# Altium project BTL_test_1.PrjPcb
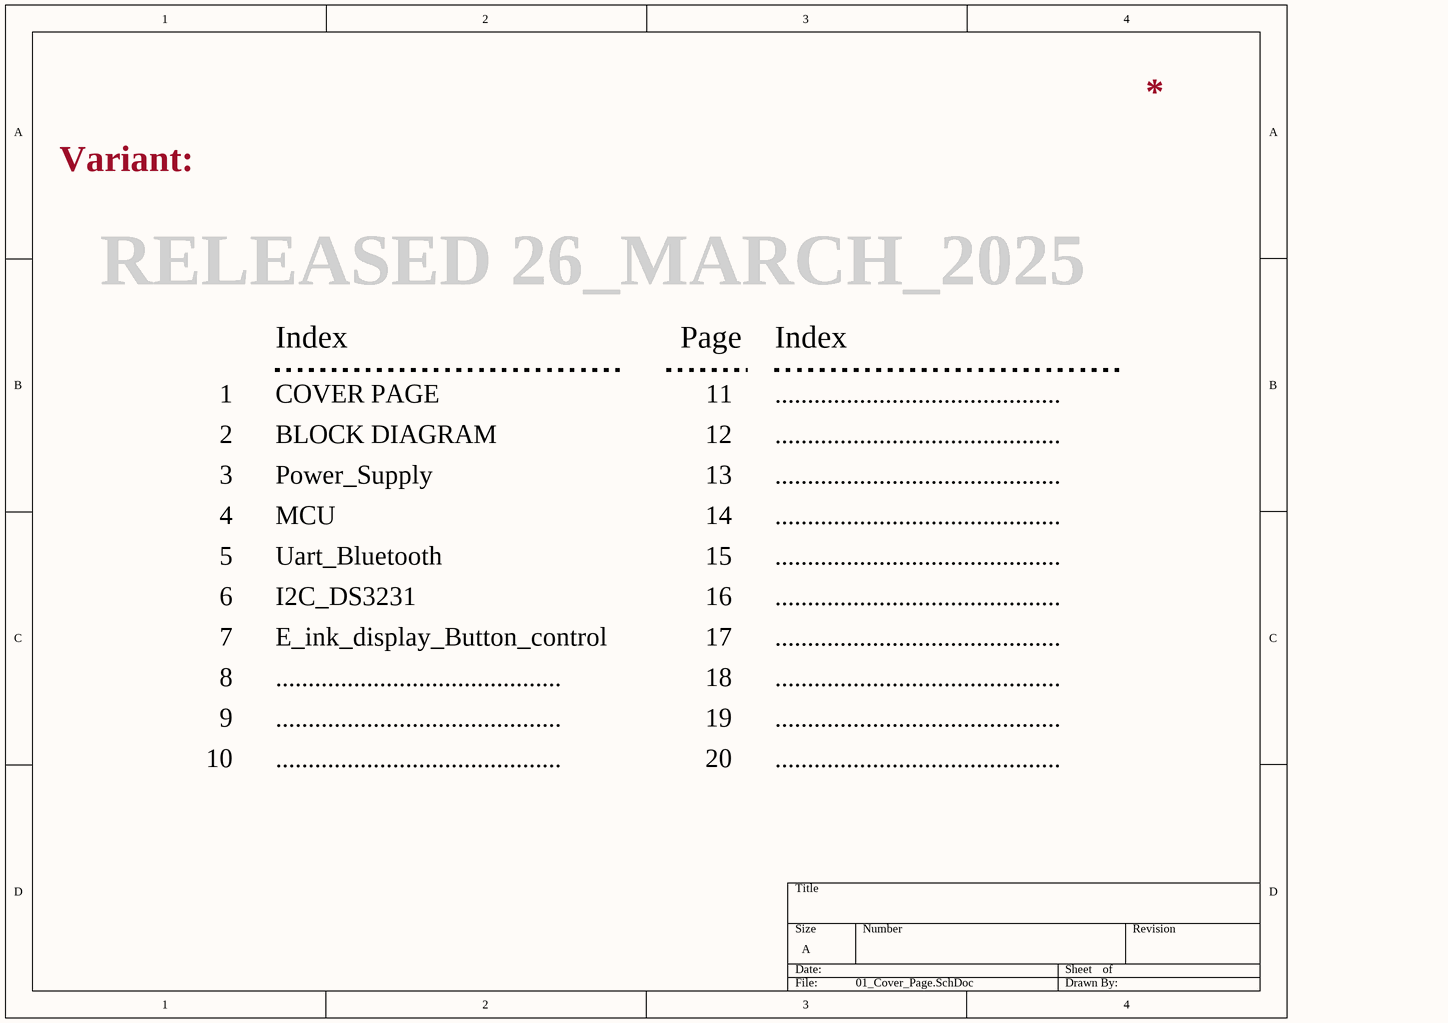
[diagram p0: 01_Cover_Page.SchDoc]
8 sheets, 69 parts. Net scope: global (net labels, ports and power ports of the same name join across sheets).
Board files: version_1.PcbDoc, version_2.PcbDoc, version_3.PcbDoc
Sheets:
  01_Cover_Page.SchDoc
  02_Block_Diagram.SchDoc
  03_Power_Spply.SchDoc
  04_MCU.SchDoc
  05_Uart_Bluetooth.SchDoc
  06_I2C_DS3231.SchDoc
  07_E_ink_display_Button_control.SchDoc
  08_ADC_measure.SchDoc

## Sheet 01_Cover_Page.SchDoc
size A; SheetNumber: 1; SheetTotal: 7

### Notes on the sheet
- Variant:
- RELEASED 26_MARCH_2025
- Index
- Page
- 1
- COVER PAGE
- 11
- ............................................
- 2
- 3
- BLOCK DIAGRAM
- Power_Supply
- 12
- 13
- 4
- 5
- MCU
- Uart_Bluetooth
- 14
- 15
- 6
- I2C_DS3231
- 16
- 7
- 8
- E_ink_display_Button_control
- 17
- 18
- 9
- 10
- 19
- 20

## Sheet 02_Block_Diagram.SchDoc
size A3; SheetNumber: 2; SheetTotal: 8
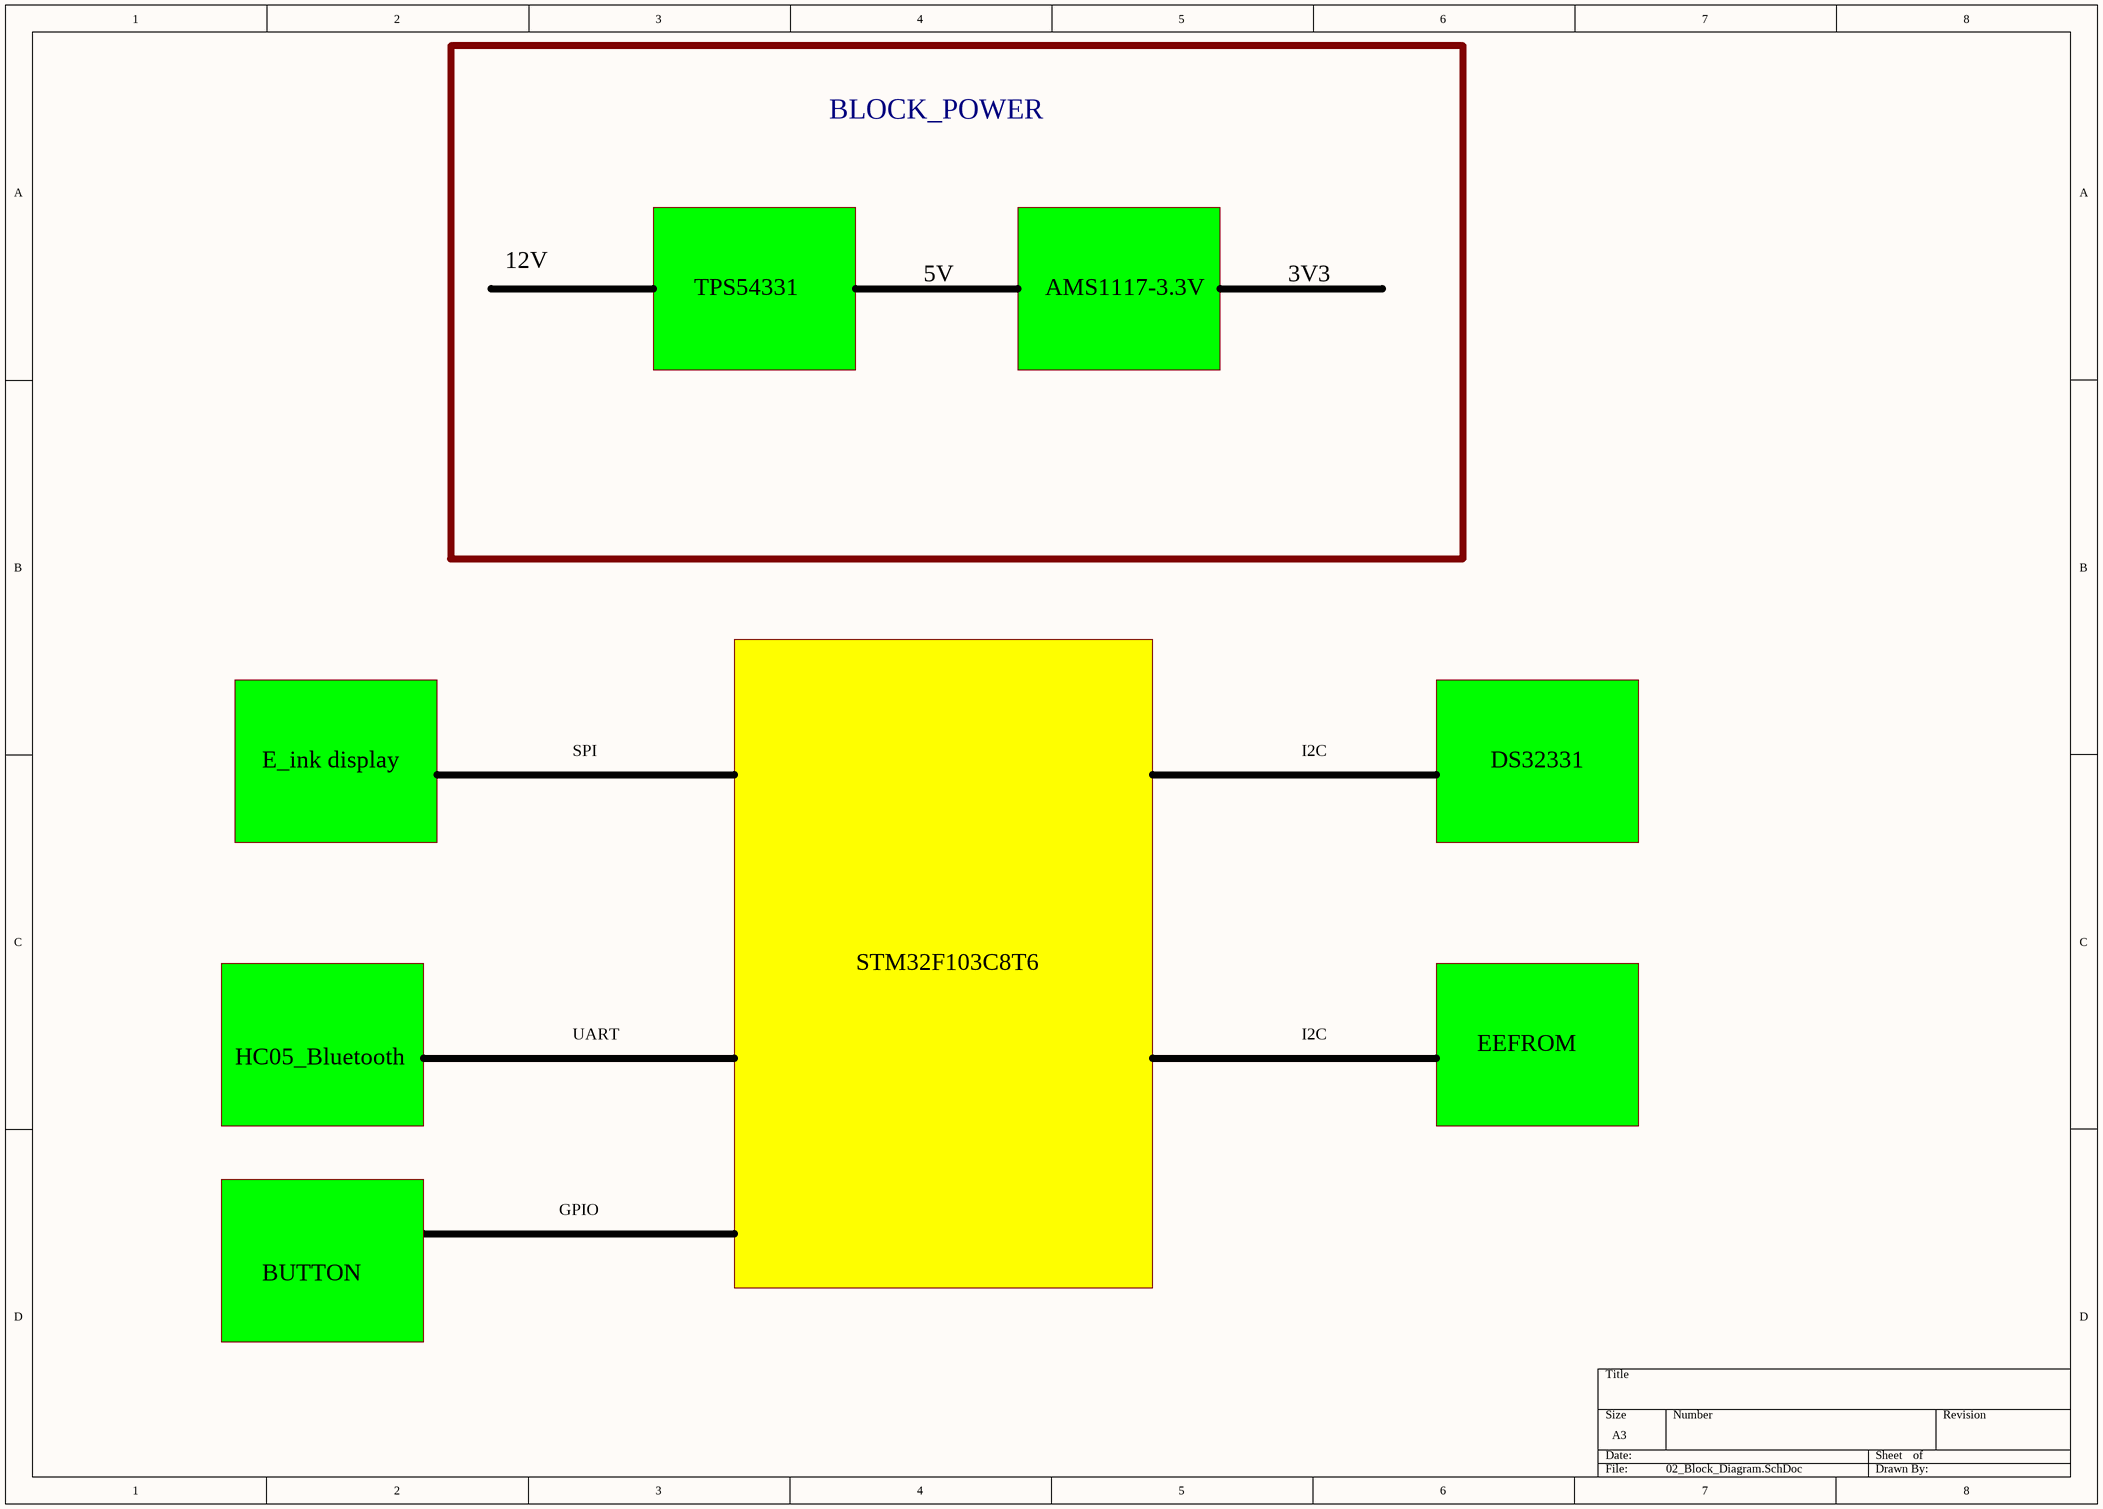
[diagram p1: 02_Block_Diagram.SchDoc]

### Notes on the sheet
- BLOCK_POWER
- 12V
- TPS54331
- 5V
- AMS1117-3.3V
- 3V3
- E_ink display
- SPI
- I2C
- DS32331
- STM32F103C8T6
- UART
- EEFROM
- HC05_Bluetooth
- GPIO
- BUTTON

## Sheet 03_Power_Spply.SchDoc
size A3; SheetNumber: 3; SheetTotal: 8
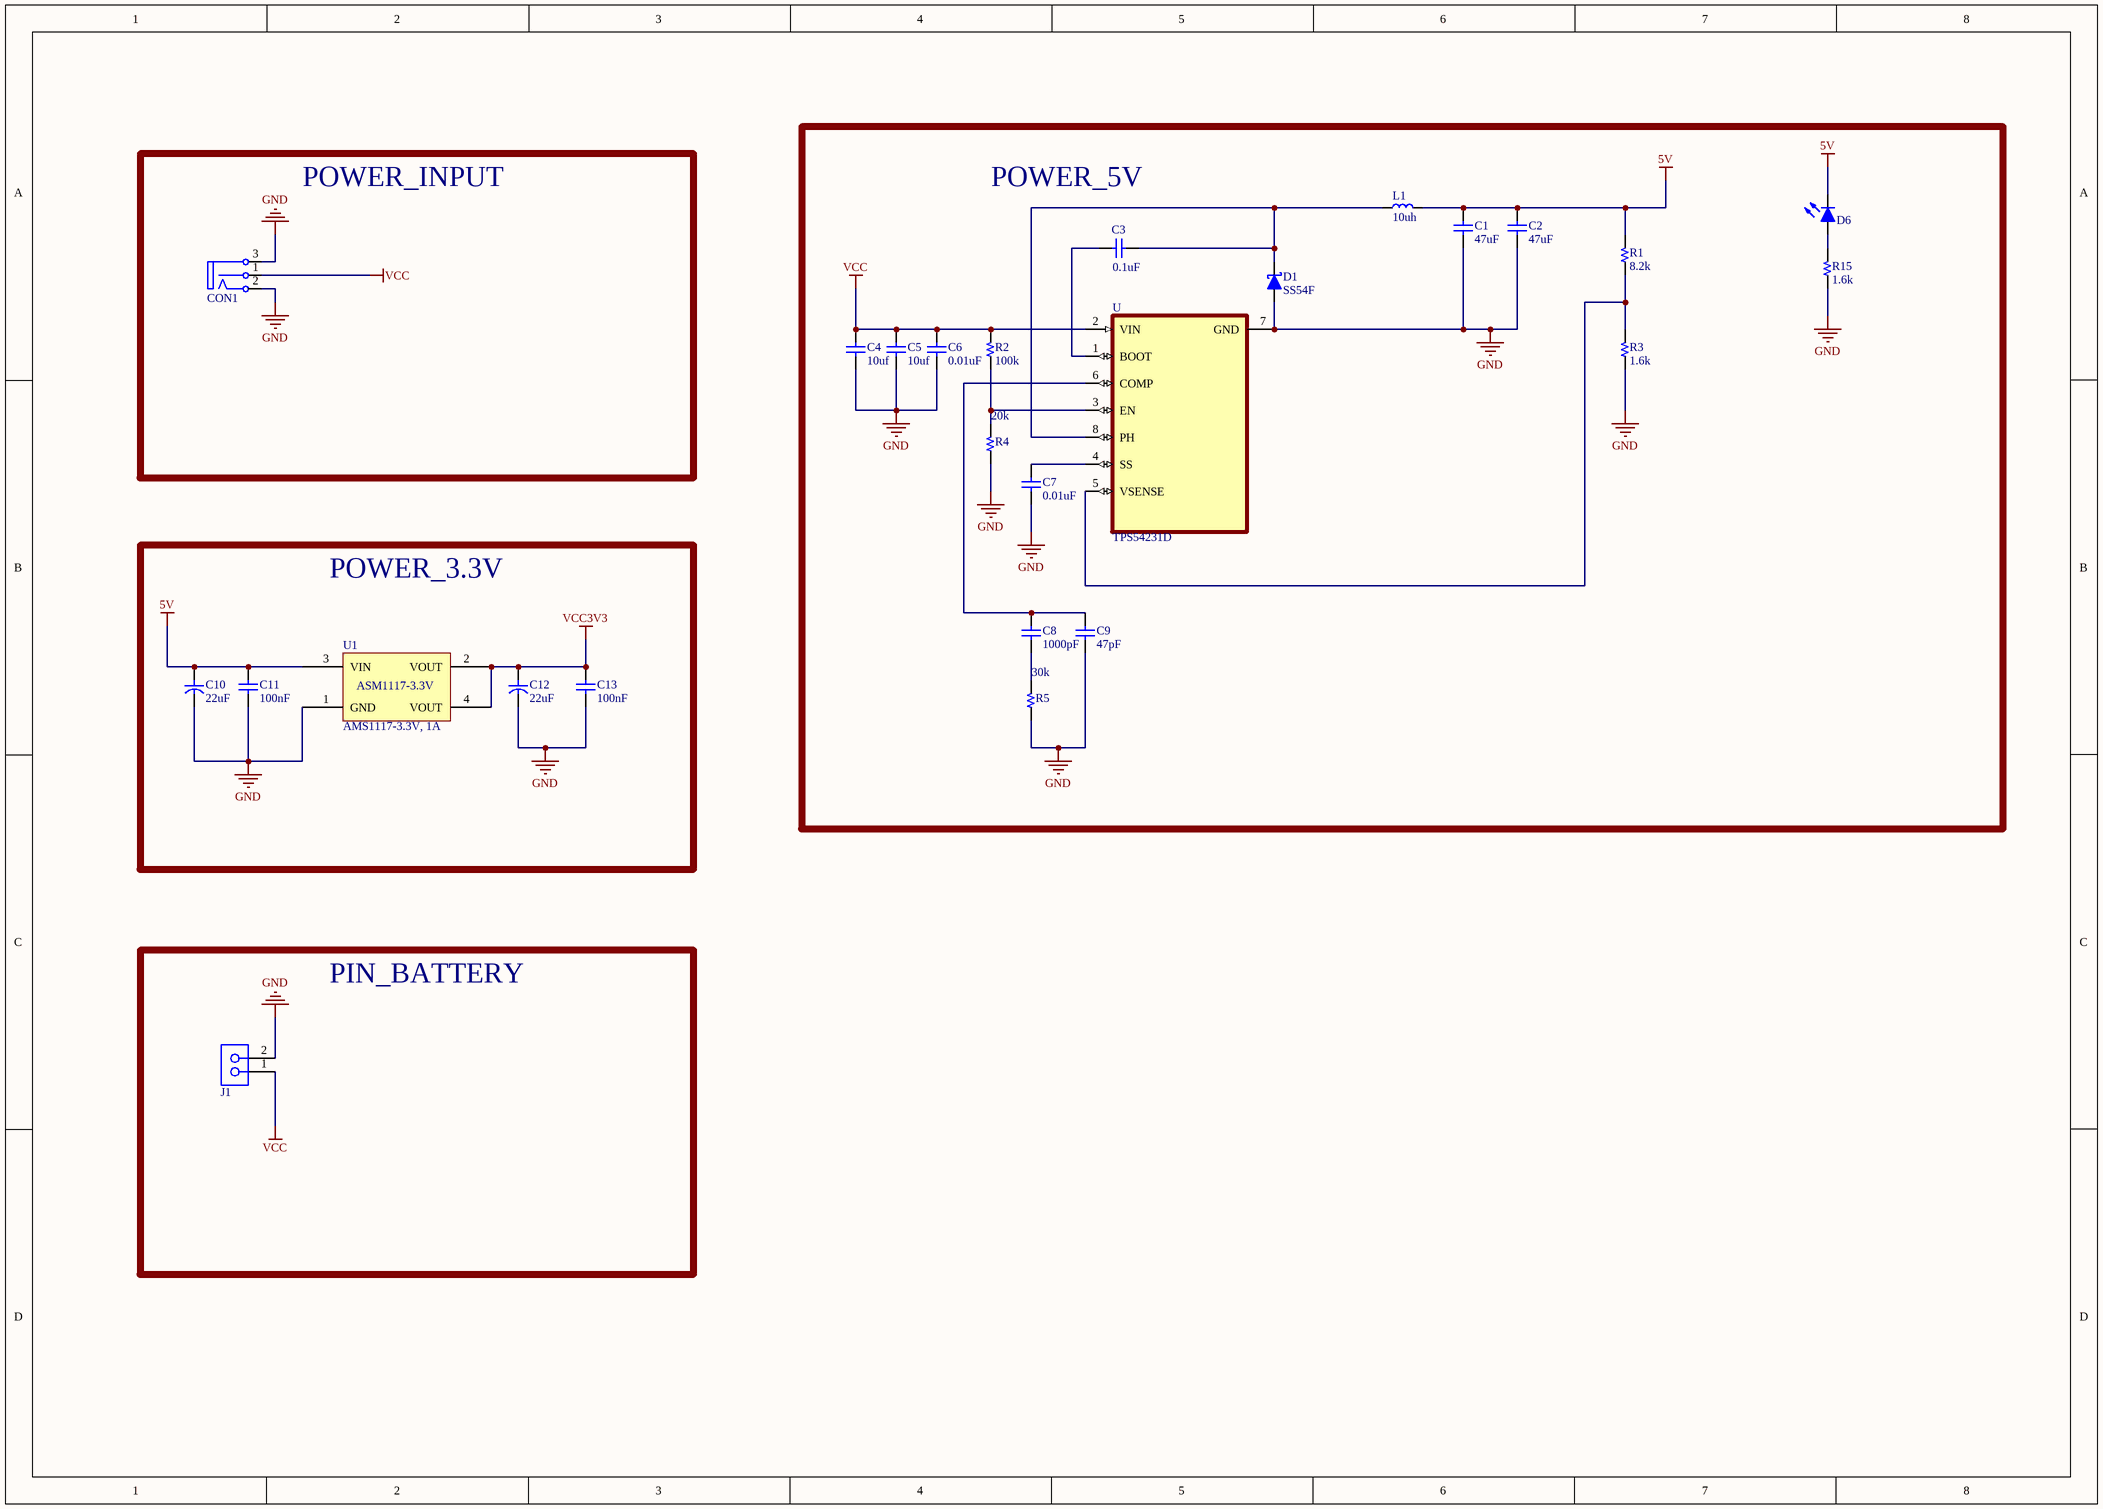
[diagram p2: 03_Power_Spply.SchDoc]

### Parts
C1  47uF  [C 0805]
C2  47uF  [C 0805]
C3  0.1uF  [C 0805]
C4  10uf  [C 0805]
C5  10uf  [C 0805]
C6  0.01uF  [C 0805]
C7  0.01uF  [C 0805]
C8  1000pF  [C 0805]
C9  47pF  [C 0805]
C10  22uF  [C SMD TAN 2312 (C)]
C11  100nF  [C 0805]
C12  22uF  [C SMD TAN 2312 (C)]
C13  100nF  [C 0805]
CON1  CON DC PWR  [CONN/DC/PWR/5.0MM]  (value not drawn)
D1  SS54F  [DO-214AC (SMA)]
D6  Led  [Led 0805]  (value not drawn)
J1  6A, 150V  [691402910002B]  (value not drawn)
L1  10uh  [Inductor SMD CDRH3D67]
R1  8.2k  [R 0805]
R2  100k  [R 0805]
R3  1.6k  [R 0805]
R4  20k  [R 0805]
R5  30k  [R 0805]
R15  1.6k  [R 0805]
U  TPS54231D  [SOIC127P599X175-8N]
U1  AMS1117-3.3V, 1A  [AMS1117-3.3V SOT223]

### Blocks framed on the sheet
POWER_5V: C1-C9 D1 D6 L1 R1-R5 R15 U
POWER_INPUT: CON1
POWER_3.3V: C10-C13 U1
PIN_BATTERY: J1

### Nets
5V: C1.2 C2.2 C10.1 C11.2 D6.2(K) L1.2 R1.2 U1.3(VIN)
GND: C1.1 C2.1 C4.1 C5.1 C6.1 C7.1 C9.1 C10.2 C11.1 C12.2 C13.1 CON1.2(T) CON1.3(TN) D1.1(A) J1.2 R3.1 R4.1 R5.1 R15.1 U.7(GND) U1.1(GND)
VCC: C4.2 C5.2 C6.2 CON1.1(S) J1.1 R2.2 U.2(VIN)
VCC3V3: C12.1 C13.2 U1.2(VOUT) U1.4(VOUT)
NetC3_1: C3.1 D1.2(K) L1.1 U.8(PH)
NetC3_2: C3.2 U.1(BOOT)
NetC7_2: C7.2 U.4(SS)
NetC8_1: C8.1 R5.2
NetC8_2: C8.2 C9.2 U.6(COMP)
NetD6_1: D6.1(A) R15.2
NetR1_1: R1.1 R3.2 U.5(VSENSE)
NetR2_1: R2.1 R4.2 U.3(EN)

### Notes on the sheet
- (in symbol AMS1117-3.3V) ASM1117-3.3V

### Library data of the parts
C1-C9 C11 C13 = Capacitor NP: Capacitor non-pol
C10 C12 = Capacitor: Capacitor pol
CON1 = CON DC PWR: DC input connector
D1 = Diode Schottky: Schottky Diode
D6 = Led: Typical LED
J1 = 691402910002B: WR-TBL Series 4029 Horizontal Entry, THT, pitch 2.54mm, 2p; Manufacturer: Wurth Elektronik; Modularity: No; ComponentLink1Description: Datasheet; ComponentLink1URL: https://www.we-online.com/redexpert/spec/691402910002B?ad; Manufacturer Part Number: 691402910002B; Category: Terminal Blocks; Match Code: WR-TBL; Mount: Through Hole; Operating Temperature Max: 105°C; Operating Temperature Min: -40°C; Packaging: Box; Application: Screwless; Number of Pins: 2; Number of Rows: 1; Orientation: Horizontal; Pitch: 2.54mm; Rated Current: 6A; Working Voltage: 150V; Supplier 1 URL: N/A; Supplier 2 URL: N/A; Supplier 3 URL: https://www.thegioiic.com/kf141-2-54-2-r-terminal-block-2-tiep-diem-cam-day-ngang-2-54mm-150v-2a; Value: 6A, 150V; LCSC Part #: N/A; Supplier 1: Mouser; Supplier 1 Part Number: N/A; Supplier 2: Digi-Key; Supplier 2 Part Number: N/A; Supplier 3: thegioiic; Supplier 3 Part Number: N/A
L1 = Inductor
R1-R5 R15 = Resistor
U = TPS54231D: å…·æœ‰Eco-modeï¼†tradeçš„3.5è‡³28Vè¾“å…¥ï¼Œ2Aï¼Œ570kHzé™åŽ‹è½¬æ¢å™¨ï¼›8-SOIC -40è‡³150; MF: Texas Instruments; DigiKey-Purchase-URL: https://snapeda.com/shop?store=DigiKey&id=456068; Value: *; MP: TPS54231D; Availability: Unavailable; Price: None; Texas_Instruments-Purchase-URL: https://snapeda.com/shop?store=Texas+Instruments&id=456068; Package: SOIC-8 Texas Instruments; SnapEDA_Link: https://www.snapeda.com/parts/TPS54231D/Texas%20Instruments/view-part/456068/?ref=snap
U1 = AMS1117-3.3V: 1A 60dB@(120Hz) Fixed 3.3V Positive electrode 12V SOT-223 Linear Voltage Regulators (LDO) ROHS; Manufacturer: AMS; Pad Count: 4; Voltage Input Maximum: 15V; Manufacturer Part Number: N/A; Current Input Maximum: N/A; Current Output Maximum: 1A; Voltage Output: 3.3V; Supplier 1 URL: N/A; Supplier 2 URL: N/A; Supplier 3 URL: https://www.thegioiic.com/ams1117-3-3v-ic-on-ap-3-3v-1a-sot-223; Value: AMS1117-3.3V, 1A; Mount: SMD/SMT; Operating Temperature Max: + 85 C; Operating Temperature Min: - 40 C; Packaging: Tape and Reel; Supplier 1: Mouser; Supplier 1 Part Number: N/A; Supplier 2: Digi-Key; Supplier 2 Part Number: N/A; Supplier 3: thegioiic; Supplier 3 Part Number: N/A; ComponentLink1Description: Datasheet; ComponentLink1URL: http://www.advanced-monolithic.com/pdf/ds1117.pdf; LCSC Part #: C347222

## Sheet 04_MCU.SchDoc
size A3; SheetNumber: 4; SheetTotal: 8
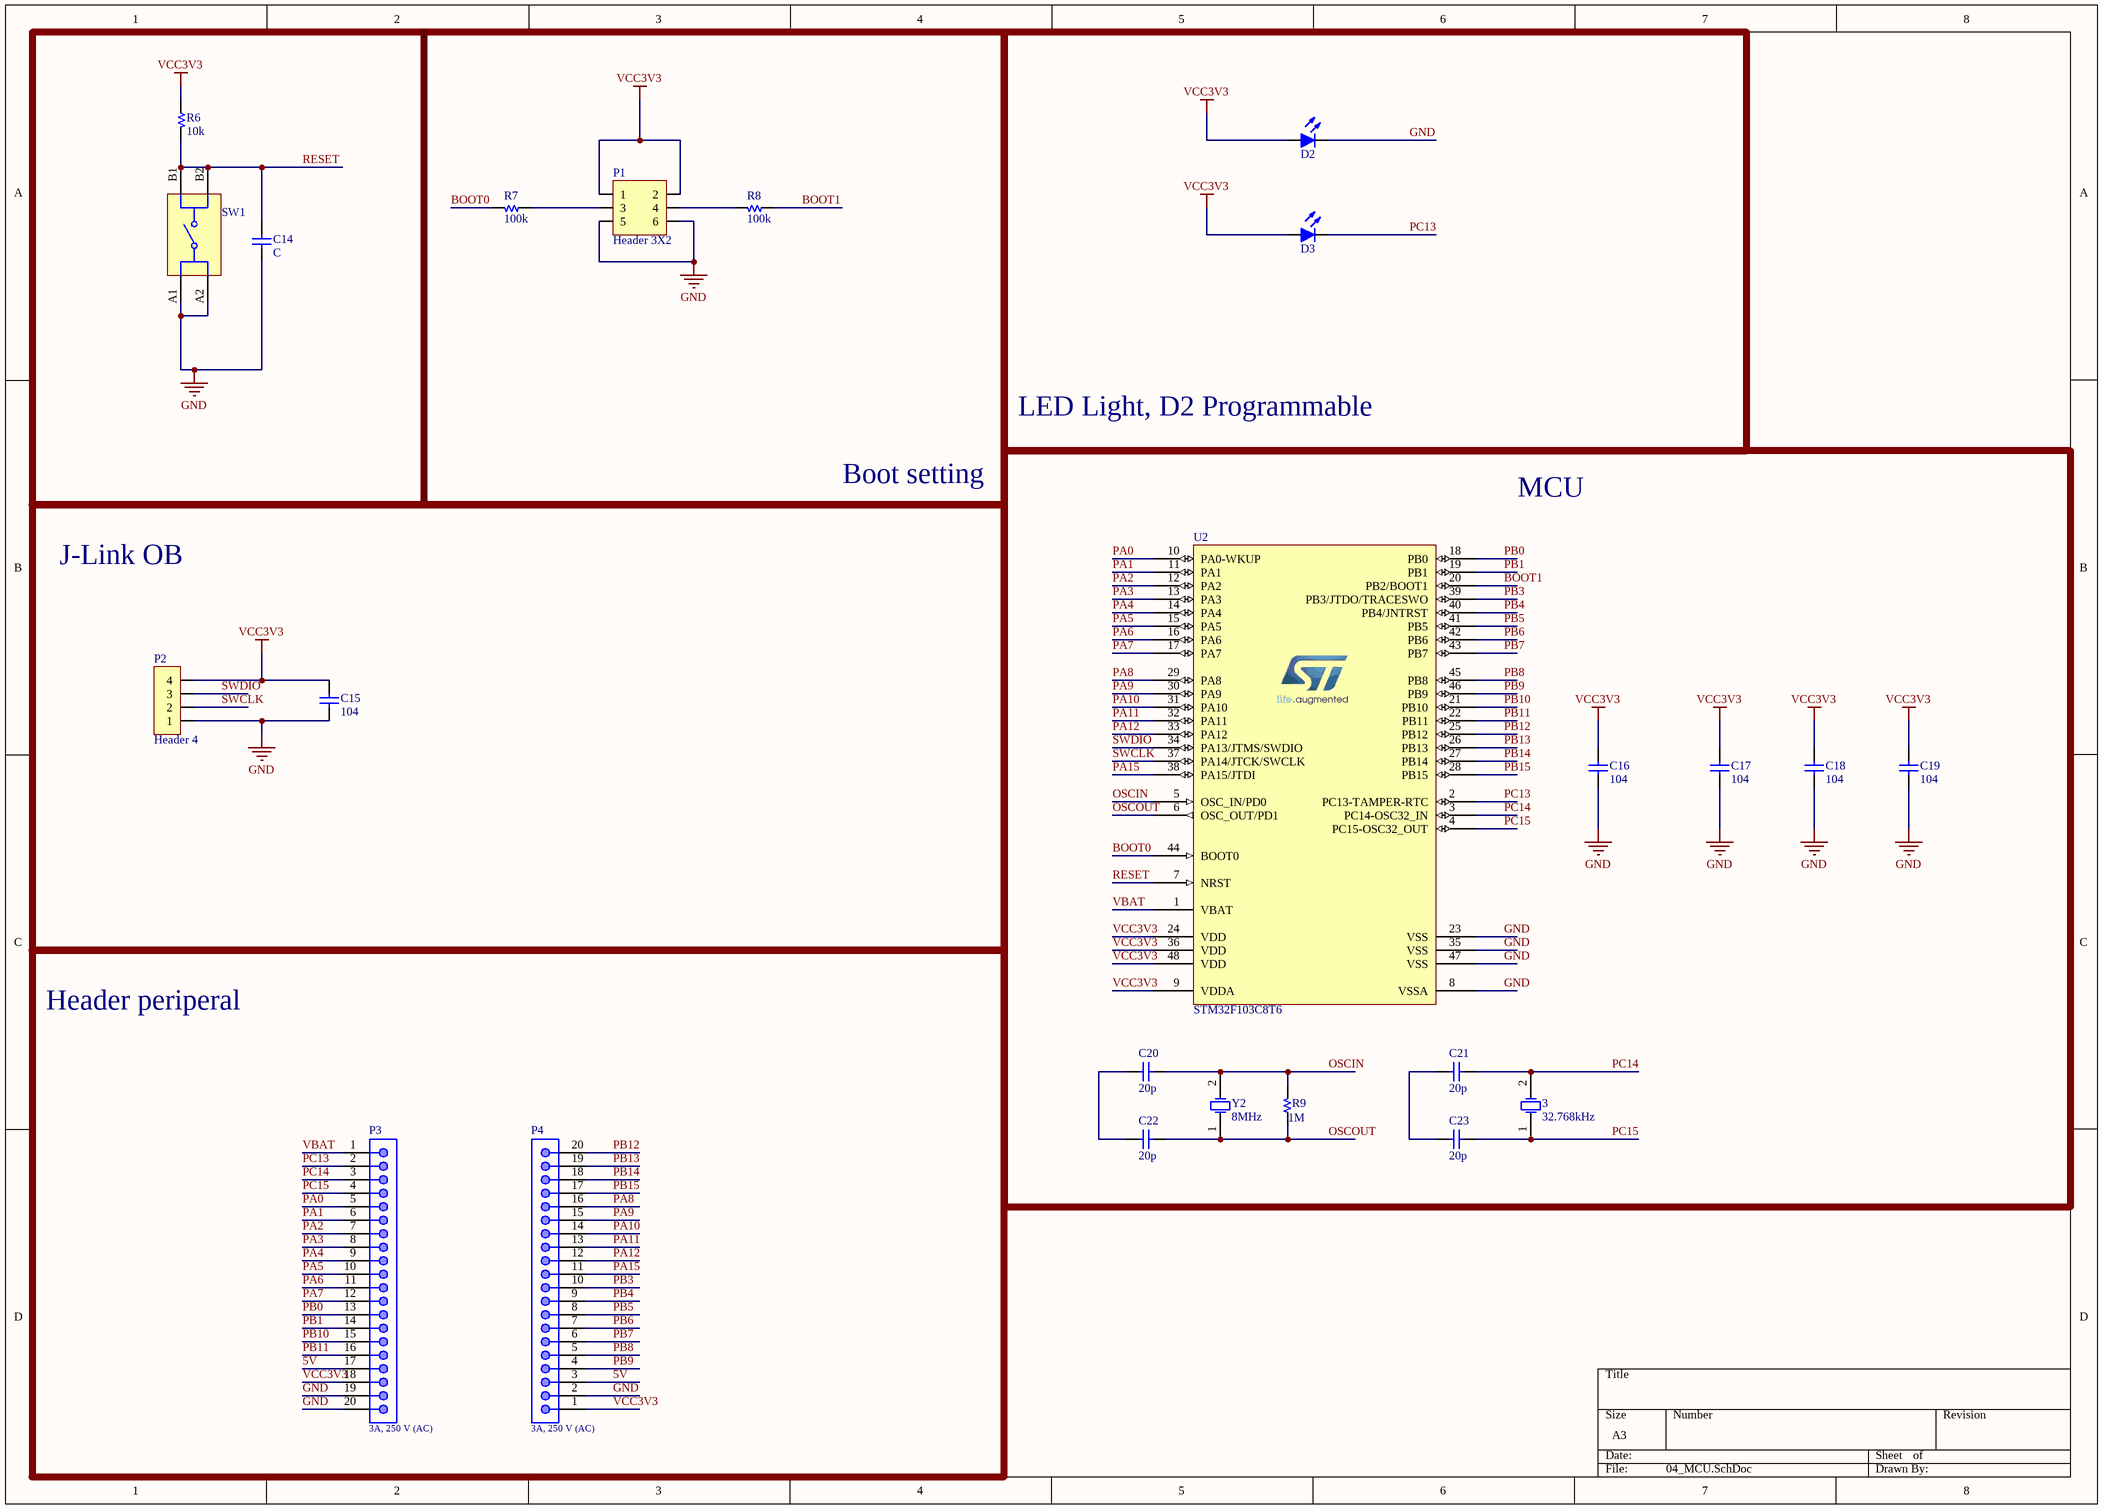
[diagram p3: 04_MCU.SchDoc]

### Parts
3  32.768kHz  [XKXGI-SUA-32.768K]
C14  C  [C 0805]
C15  104  [C 0805]
C16  104  [C 0805]
C17  104  [C 0805]
C18  104  [C 0805]
C19  104  [C 0805]
C20  20p  [C 0805]
C21  20p  [C 0805]
C22  20p  [C 0805]
C23  20p  [C 0805]
D2  Led  [Led 0805]  (value not drawn)
D3  Led  [Led 0805]  (value not drawn)
P1  Header 3X2  [HDR/Header/6/DL]
P2  Header 4  [HDR/Header/4]
P3  3A, 250 V (AC)  [61302011121]
P4  3A, 250 V (AC)  [61302011121]
R6  10k  [R 0805]
R7  100k  [R 0805]
R8  100k  [R 0805]
R9  1M  [R 0805]
SW1  430152043826  [WS-TASV_L6W6H4.3_4301x20438x6]  (value not drawn)
U2  STM32F103C8T6  [STM32F103C8T6]
Y2  8MHz  [WE-XTAL_HC49/4HSMX]

### Blocks framed on the sheet
Boot setting: C14 P1 R6-R8 SW1
LED Light, D2 Programmable: D2 D3
MCU: 3 C16-C23 R9 U2 Y2
Header periperal: P3 P4

### Nets
5V: P3.17 P4.3
GND: C14.2 C15.2 C16.1 C17.1 C18.1 C19.1 D2.2(K) P1.5 P1.6 P2.1 P3.19 P3.20 P4.2 SW1.A1 SW1.A2 U2.8(VSSA) U2.23(VSS) U2.35(VSS) U2.47(VSS)
VCC3V3: C15.1 C16.2 C17.2 C18.2 C19.2 D2.1(A) D3.1(A) P1.1 P1.2 P2.4 P3.18 P4.1 R6.1 U2.9(VDDA) U2.24(VDD) U2.36(VDD) U2.48(VDD)
BOOT0: R7.2 U2.44(BOOT0)
BOOT1: R8.1 U2.20(PB2/BOOT1)
OSCIN: C20.1 R9.2 U2.5(OSC_IN/PD0) Y2.2(OSC2)
OSCOUT: C22.1 R9.1 U2.6(OSC_OUT/PD1) Y2.1(OSC1)
PA0: P3.5 U2.10(PA0-WKUP)
PA1: P3.6 U2.11(PA1)
PA2: P3.7 U2.12(PA2)
PA3: P3.8 U2.13(PA3)
PA4: P3.9 U2.14(PA4)
PA5: P3.10 U2.15(PA5)
PA6: P3.11 U2.16(PA6)
PA7: P3.12 U2.17(PA7)
PA8: P4.16 U2.29(PA8)
PA9: P4.15 U2.30(PA9)
PA10: P4.14 U2.31(PA10)
PA11: P4.13 U2.32(PA11)
PA12: P4.12 U2.33(PA12)
PA15: P4.11 U2.38(PA15/JTDI)
PB0: P3.13 U2.18(PB0)
PB1: P3.14 U2.19(PB1)
PB3: P4.10 U2.39(PB3/JTDO/TRACESWO)
PB4: P4.9 U2.40(PB4/JNTRST)
PB5: P4.8 U2.41(PB5)
PB6: P4.7 U2.42(PB6)
PB7: P4.6 U2.43(PB7)
PB8: P4.5 U2.45(PB8)
PB9: P4.4 U2.46(PB9)
PB10: P3.15 U2.21(PB10)
PB11: P3.16 U2.22(PB11)
PB12: P4.20 U2.25(PB12)
PB13: P4.19 U2.26(PB13)
PB14: P4.18 U2.27(PB14)
PB15: P4.17 U2.28(PB15)
PC13: D3.2(K) P3.2 U2.2(PC13-TAMPER-RTC)
PC14: 3.2(OSC2) C21.1 P3.3 U2.3(PC14-OSC32_IN)
PC15: 3.1(OSC1) C23.1 P3.4 U2.4(PC15-OSC32_OUT)
RESET: C14.1 R6.2 SW1.B1 SW1.B2 U2.7(NRST)
SWCLK: P2.2 U2.37(PA14/JTCK/SWCLK)
SWDIO: P2.3 U2.34(PA13/JTMS/SWDIO)
VBAT: P3.1 U2.1(VBAT)
NetC20_2: C20.2 C22.2
NetC21_2: C21.2 C23.2
NetP1_3: P1.3 R7.1
NetP1_4: P1.4 R8.2

### Notes on the sheet
- J-Link OB

### Library data of the parts
3 = XKXGI-SUA-32.768K: 32.768kHz Surface Mount Crystal 12.5pF ±20ppm ±30ppm SMD3215-2P Crystals ROHS; Manufacturer: YXC Crystal Oscillators; Frequency Stability: +/-30ppm; Frequency Tolerance: +/-20ppm; ComponentLink1Description: Datasheet; ComponentLink1URL: https://www.lcsc.com/datasheet/lcsc_datasheet_2210261730_YXC-Crystal-Oscillators-XKXGI-SUA-32-768K_C5213671.pdf; Frequency: 32.768kHz; LCSC Part #: C5213671; Load Capacitance: 12.5pF; Manufacturer Part Number: XKXGI-SUA-32.768K; Mount: SMD/SMT; Operating Temperature Max: + 85 C; Operating Temperature Min: - 40 C; Package / Case: SMD3215-2P; Packaging: Tape and Reel; Supplier 1: Mouser; Supplier 1 Part Number: N/A; Supplier 1 URL: N/A; Supplier 2: Digi-Key; Supplier 2 Part Number: N/A; Supplier 2 URL: N/A; Supplier 3: thegioiic; Supplier 3 Part Number: N/A; Supplier 3 URL: N/A; Value: 32.768kHz
C14-C23 = Capacitor NP: Capacitor non-pol
D2 D3 = Led: Typical LED
P1 = Header 3X2: Header, 3-Pin, Dual row
P2 = Header 4: Header, 4-Pin
P3 P4 = 61302011121: WR-PHD Pin Header, THT, pitch 2.54mm, Single Row, Vertical, 20p; Manufacturer: Wurth Elektronik; Pin Number: 20; Working Voltage: 250VAC; Withstanding Voltage: 500VAC; Contact Resistance: 20mOhm; ComponentLink1Description: Datasheet; ComponentLink1URL: https://www.we-online.com/catalog/datasheet/61302011121.pdf; Manufacturer Part Number: 61302011121; Published Date: May 2020; Pitch: 2.54mm; Packaging: Bag; Gender: Pin Header; Rated Current: 3A; Row Number: Single; Orientation: Vertical; Supplier 1 URL: https://www.mouser.vn/ProductDetail/Wurth-Elektronik/61302011121?qs=PhR8RmCirEbj%2FFsnpbhNaw%3D%3D; Supplier 2 URL: N/A; Supplier 3 URL: N/A; LCSC Part #: N/A; Mount: THT; Operating Temperature Max: + 85 C; Operating Temperature Min: - 25 C; Supplier 1: Mouser; Supplier 1 Part Number: 710-61302011121; Supplier 2: Digi-Key; Supplier 2 Part Number: N/A; Supplier 3: thegioiic; Supplier 3 Part Number: N/A; Value: 3A, 250 V (AC)
R6-R9 = Resistor
SW1 = 430152043826: WS-TASV SMT Tact Switch, L6 x W6 x H4.3mm, 260g, SPST-NO, 12V, 50mA; Manufacturer: Wurth Elektronik; Washable: No; Rated Voltage: 12VDC; Manufacturer Part Number: 430152043826; Category: Tact Switches; Match Code: WS-TASV; Mount: Surface Mount; Operating Temperature Max: 85°C; Operating Temperature Min: -40°C; Packaging: Tape and Reel; Length: 6mm; Width: 6mm; Height: 4.3mm; Circuit: SPST-NO; Contact Material: Stainless Steel; Operation Force: 260g; Rated Current: 50mA; Terminal Material: Copper Alloy; Terminal Plating: Silver; Supplier 1 URL: https://www.mouser.vn/ProductDetail/Wurth-Elektronik/430152043826?qs=wr8lucFkNMUjBcFj1giTsA%3D%3D; Supplier 2 URL: https://www.digikey.com/en/products/detail/w%C3%BCrth-elektronik/430152043826/5208994; Supplier 3 URL: https://www.thegioiic.com/nut-nhan-6x6mm-cao-4-3mm-4-chan-smd; LCSC Part #: N/A; ComponentLink1Description: Datasheet; ComponentLink1URL: https://www.we-online.com/redexpert/spec/430152043826?ad; Package / Case: 0805; Supplier 1: Mouser; Supplier 1 Part Number: 710-430152043826; Supplier 2: Digi-Key; Supplier 2 Part Number: 732-6991-2-ND; Supplier 3: thegioiic; Supplier 3 Part Number: OEM; Value: 430152043826
U2 = STM32F103C8T6: ARM Microcontrollers - MCU 32BIT Cortex M3 64KB 20KB RAM 2X12 ADC; Manufacturer: STMicroelectronics; Manufacturer Part Number: STM32F103C8T6TR; Pad count: 48; Supply Voltage - Max: 3.6 V; Supply Voltage - Min: 2 V; Part Number: STM32F103C8T6; Value: STM32F103C8T6; Supplier 1 URL: https://www.mouser.com/ProductDetail/STMicroelectronics/STM32F103C8T6?qs=bhCVus9SdFtq6kqxsU5%2FDA%3D%3D; Supplier 2 URL: https://www.digikey.com/en/products/detail/stmicroelectronics/stm32f103c8t6tr/2122442; Supplier 3 URL: https://www.thegioiic.com/stm32f103c8t6-32-bit-arm-cortex-m3-microcontroller-72mhz-64kb-flash-48-lqfp; Packaging: Tape and Reel; Supplier 1: Mouser; Supplier 1 Part Number: 511-STM32F103C8T6; Supplier 2: Digi-Key; Supplier 2 Part Number: 497-17666-2-ND; Supplier 3: thegioiic; Supplier 3 Part Number: STM32F103C8T6; Mount: SMD/SMT; Operating Temperature Max: + 85 C; Operating Temperature Min: - 40 C; Package / Case: LQFP48; ComponentLink1Description: Datasheet; ComponentLink1URL: https://www.mouser.com/datasheet/2/389/stm32f103c8-1851025.pdf; LCSC Part #: C8734
Y2 = 071105086016: WE-XTAL Quartz Crystal, SMT, HC49/4HSMX, 8MHz, +/-30ppm; Manufacturer Part Number: 830003151; Manufacturer: Wurth Elektronik; Frequency Stability: +/-50ppm; Load Capacitance: 16pF; Frequency: 8MHz; Frequency Tolerance: +/-30ppm; Supplier 3 URL: https://www.thegioiic.com/thach-anh-8mhz-2-chan-smd-hc49-s; ComponentLink1Description: Datasheet; ComponentLink1URL: https://katalog.we-online.com/pbs/datasheet/830003151.pdf; Supplier 1 URL: https://www.mouser.com/ProductDetail/Wurth-Elektronik/830003151?qs=2WXlatMagcHisY7XHApyYg%3D%3D; Supplier 2 URL: https://www.digikey.com/en/products/detail/w%C3%BCrth-elektronik/830003151/13979296; Value: 8MHz; Mount: SMD/SMT; Operating Temperature Max: + 60 C; Operating Temperature Min: - 10 C; Package / Case: HC49/4HSMX; Packaging: Tape and Reel; Supplier 1: Mouser; Supplier 1 Part Number: 710-830003151; Supplier 2: Digi-Key; Supplier 2 Part Number: 732-830003151TR-ND; Supplier 3: thegioiic; Supplier 3 Part Number: N/A

## Sheet 05_Uart_Bluetooth.SchDoc
size A3; SheetNumber: 5; SheetTotal: 8
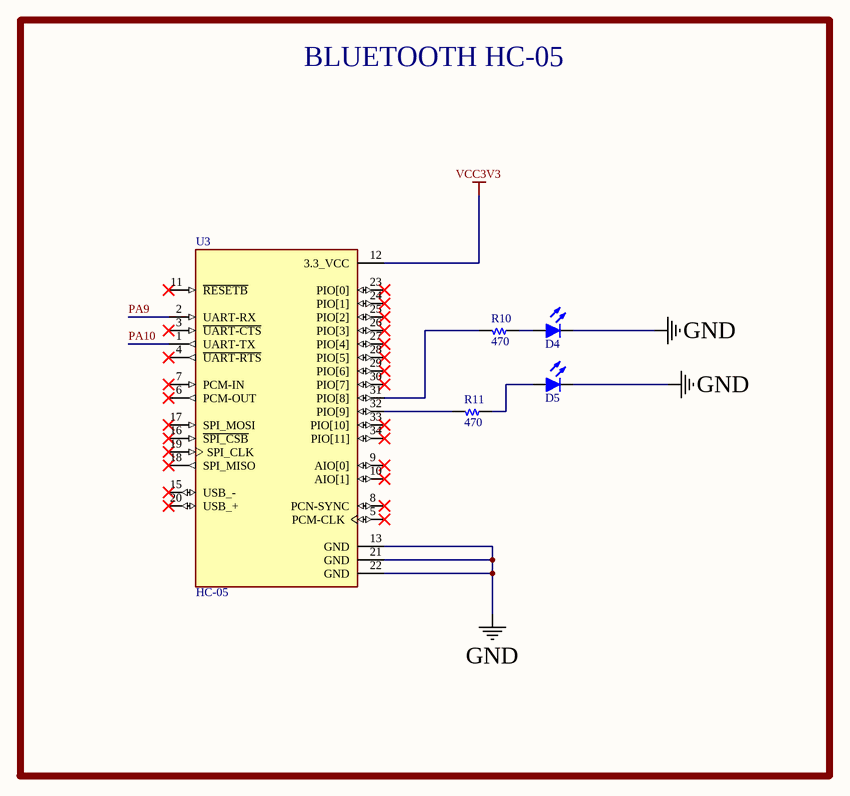
[diagram p4: 05_Uart_Bluetooth.SchDoc]

### Parts
D4  Led  [Led 0805]  (value not drawn)
D5  Led  [Led 0805]  (value not drawn)
R10  470  [R 0805]
R11  470  [R 0805]
U3  HC-05  [XCVR_HC-05]

### Blocks framed on the sheet
BLUETOOTH HC-05: D4 D5 R10 R11 U3

### Nets
GND: D4.2(K) D5.2(K) U3.13(GND) U3.21(GND) U3.22(GND)
VCC3V3: U3.12(3.3_VCC)
PA9: U3.2(UART-RX)
PA10: U3.1(UART-TX)
NetD4_1: D4.1(A) R10.1
NetD5_1: D5.1(A) R11.1
NetR10_2: R10.2 U3.31(PIO[8])
NetR11_2: R11.2 U3.32(PIO[9])

Not connected (* = marked no-connect by the designer): U3 3(~{UART-CTS})* 4(~{UART-RTS})* 5(PCM-CLK)* 6(PCM-OUT)* 7(PCM-IN)* 8(PCN-SYNC)* 9(AIO[0])* 10(AIO[1])* 11(~{RESETB})* 15(USB_-)* 16(~{SPI_CSB})* 17(SPI_MOSI)* 18(SPI_MISO)* 19(SPI_CLK)* 20(USB_+)* 23(PIO[0])* 24(PIO[1])* 25(PIO[2])* 26(PIO[3])* 27(PIO[4])* 28(PIO[5])* 29(PIO[6])* 30(PIO[7])* 33(PIO[10])* 34(PIO[11])*

### Library data of the parts
D4 D5 = Led: Typical LED
R10 R11 = Resistor
U3 = HC-05: Bluetooth to Serial Port Module; MP: HC-05; Value: *; Price: None; Package: None; Availability: Unavailable

## Sheet 06_I2C_DS3231.SchDoc
size A3; SheetNumber: 5; SheetTotal: 5
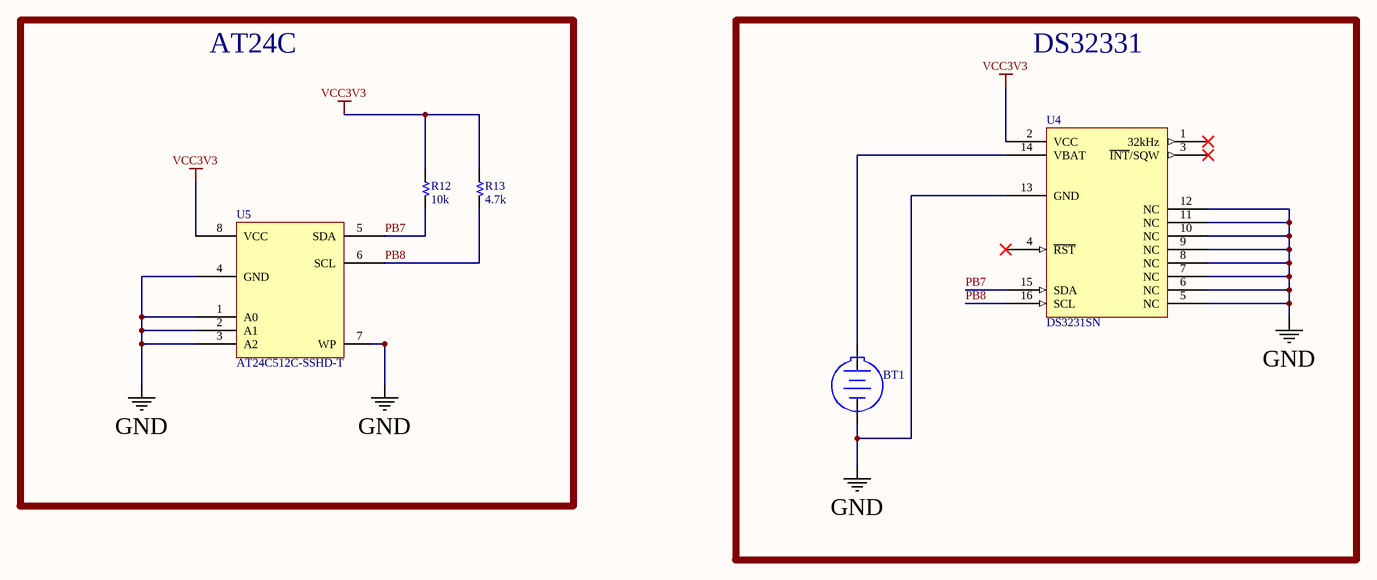
[diagram p5: 06_I2C_DS3231.SchDoc]

### Parts
BT1  79527141  [79527141]  (value not drawn)
R12  10k  [R 0805]
R13  4.7k  [R 0805]
U4  DS3231SN  [DS3231SN-16SOIC]
U5  AT24C512C-SSHD-T  [M24M01-RMN6TP]

### Blocks framed on the sheet
AT24C: R12 R13 U5
DS32331: BT1 U4

### Nets
GND: BT1.2(-) U4.5(NC) U4.6(NC) U4.7(NC) U4.8(NC) U4.9(NC) U4.10(NC) U4.11(NC) U4.12(NC) U4.13(GND) U5.1(A0) U5.2(A1) U5.3(A2) U5.4(GND) U5.7(WP)
VCC3V3: R12.1 R13.1 U4.2(VCC) U5.8(VCC)
PB7: R12.2 U4.15(SDA) U5.5(SDA)
PB8: R13.2 U4.16(SCL) U5.6(SCL)
NetBT1_1: BT1.1(+) U4.14(VBAT)

Not connected (* = marked no-connect by the designer): U4 1(32kHz)* 3(~{INT}/SQW)* 4(~{RST})*

### Library data of the parts
BT1 = 79527141: WA-BCPH Battery Holder, SMT, battery type 2032; Manufacturer: Wurth Elektronik; Battery Type: 2032; ComponentLink1Description: Website Link; ComponentLink1URL: https://www.we-online.com/redexpert/article/79527141?ad; ComponentLink2Description: Datasheet Link; ComponentLink2URL: https://www.we-online.com/redexpert/spec/79527141?ad; Manufacturer Part Number: 79527141; Category: Battery Holders; Match Code: WA-BCPH; Mount: Surface Mount; Operating Temperature Max: 105°C; Operating Temperature Min: -40°C; Packaging: Tape and Reel
R12 R13 = Resistor
U4 = DS3231SN-16SOIC: IC RTC CLK/CALENDAR I2C 16SOIC; Manufacturer: Analog Devices Inc./Maxim Integrated; Operating Supply Current: 110 - 170 (µA); RTC Bus Interface: I2C, Serial; Time Format: HH:MM:SS (12 hr, 24 hr); Supply Voltage - Max: 5.5 V; Supply Voltage - Min: 2.3 V; RTC Memory Size: N/A; Supplier 1 URL: https://www.mouser.com/ProductDetail/Analog-Devices-Maxim-Integrated/DS3231SN?qs=ffX8NcjNb2RmKAb9wAk9Ug%3D%3D; Supplier 2 URL: https://www.digikey.com/en/products/detail/analog-devices-inc-maxim-integrated/DS3231SN/1197576; Supplier 3 URL: https://www.thegioiic.com/ds3231sn-ic-rtc-clock-calendar-16-soic; Value: DS3231SN; Manufacturer Part Number: DS3231SN; Supplier 1: Mouser; Supplier 1 Part Number: 700-DS3231SN-; Supplier 2: Digi-Key; Supplier 2 Part Number: DS3231SN#-ND; Supplier 3: thegioiic; Supplier 3 Part Number: N/A; Mount: SMD/SMT; Operating Temperature Max: + 85 C; Operating Temperature Min: - 40 C; Package / Case: SOIC-16; Packaging: Tape and Reel; ComponentLink1Description: Datasheet; ComponentLink1URL: https://www.analog.com/media/en/technical-documentation/data-sheets/DS3231.pdf; LCSC Part #: N/A
U5 = AT24C512C-SSHD-T: EEPROM SERIAL EEPROM 512K (64K X 8) 2WIRE 2.5V; Manufacturer: Microchip; Interface Type: 2-Wire, I2C; Maximum Clock Frequency: 1 MHz; Memory Size: 512 kbit; Supply Voltage - Max: 5.5 V; Supplier 1 URL: https://www.mouser.vn/ProductDetail/Microchip-Technology/AT24C512C-SSHD-T?qs=Oaf4mloV4cM7Q6xetGfOtg%3D%3D; Supplier 2 URL: https://www.digikey.com/en/products/detail/microchip-technology/at24c512c-sshd-t/3046245; Supplier 3 URL: https://www.thegioiic.com/at24c512c-sshd-t-ic-eeprom-512kbit-8-soic; Value: AT24C512C-SSHD-T; Manufacturer Part Number: AT24C512C-SSHD-T; Supplier 1: Mouser; Supplier 1 Part Number: 556-AT24C512C-SSHD-T; Supplier 2: Digi-Key; Supplier 2 Part Number: AT24C512C-SSHD-TTR-ND; Supplier 3: thegioiic; Supplier 3 Part Number: AT24C512C-SSHD-T; Mount: SMD/SMT; Operating Temperature Max: + 85 C; Operating Temperature Min: - 40 C; Package / Case: SOIC-8; Packaging: Tape and Reel; Supply Voltage - Min: 2.5 V; ComponentLink1Description: Datasheet; ComponentLink1URL: https://www.mouser.vn/datasheet/2/268/AT24C512C_I_c2_b2C_Compatible__Two_Wire__Serial_EE-2306430.pdf; LCSC Part #: C12371

## Sheet 07_E_ink_display_Button_control.SchDoc
size A3; SheetNumber: 7; SheetTotal: 6
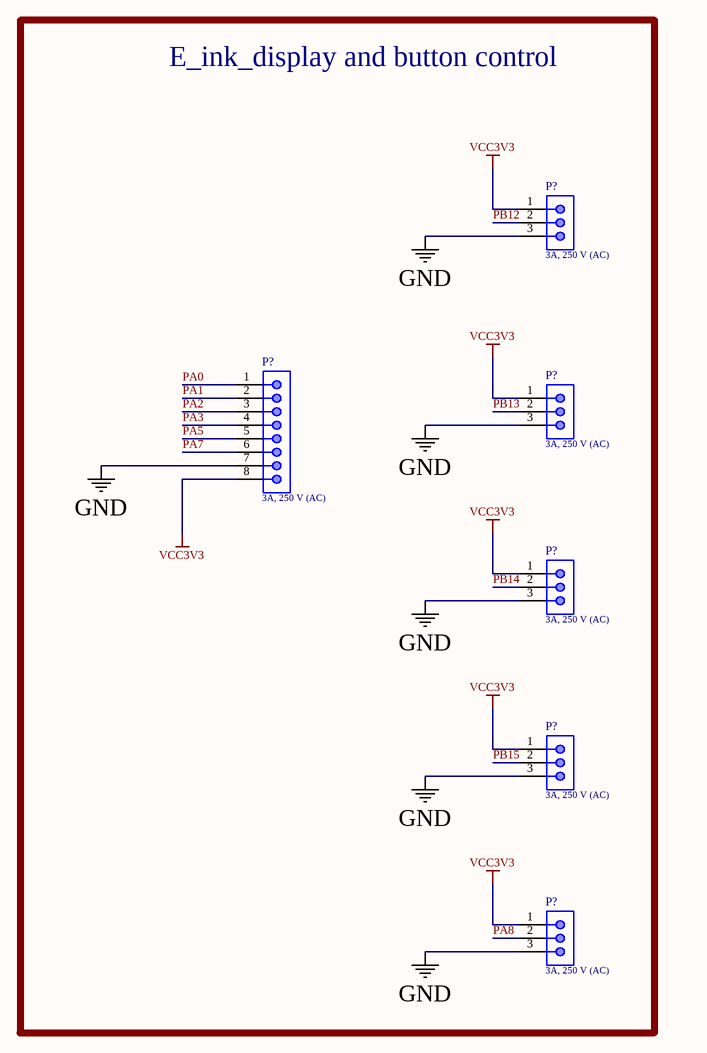
[diagram p6: 07_E_ink_display_Button_control.SchDoc]

### Parts
(Parts that share a designator on the sheet are numbered #1, #2 ... from top to bottom, then left to right.)
P?#1  3A, 250 V (AC)  [61300311121]
P?#2  3A, 250 V (AC)  [61300811121]
P?#3  3A, 250 V (AC)  [61300311121]
P?#4  3A, 250 V (AC)  [61300311121]
P?#5  3A, 250 V (AC)  [61300311121]
P?#6  3A, 250 V (AC)  [61300311121]

### Blocks framed on the sheet
E_ink_display and button control: P?#1-P?#6

### Nets
GND: P?#1.3 P?#2.7 P?#3.3 P?#4.3 P?#5.3 P?#6.3
VCC3V3: P?#1.1 P?#2.8 P?#3.1 P?#4.1 P?#5.1 P?#6.1
PA0: P?#2.1
PA1: P?#2.2
PA2: P?#2.3
PA3: P?#2.4
PA5: P?#2.5
PA7: P?#2.6
PA8: P?#6.2
PB12: P?#1.2
PB13: P?#3.2
PB14: P?#4.2
PB15: P?#5.2

### Library data of the parts
P?#1 P?#3-P?#6 = 61300311121: WR-PHD Pin Header, THT, pitch 2.54mm, Single Row, Vertical, 3p; Manufacturer: Wurth Elektronik; Pin Number: 3; Working Voltage: 250VAC; Withstanding Voltage: 500VAC; Contact Resistance: 20mOhm; ComponentLink1Description: Datasheet; ComponentLink1URL: https://www.we-online.com/catalog/datasheet/61300311121.pdf; Manufacturer Part Number: 61300311121; Published Date: May 2020; Pitch: 2.54mm; Packaging: Bag; Gender: Pin Header; Rated Current: 3A; Row Number: Single; Orientation: Vertical; Supplier 1 URL: https://www.mouser.vn/ProductDetail/Wurth-Elektronik/61300311121?qs=PhR8RmCirEYxRWFJzNKsUw%3D%3D; Supplier 2 URL: N/A; Supplier 3 URL: N/A; LCSC Part #: C2937625; Mount: THT; Operating Temperature Max: + 85 C; Operating Temperature Min: - 25 C; Supplier 1: Mouser; Supplier 1 Part Number: 710-61300311121; Supplier 2: Digi-Key; Supplier 2 Part Number: N/A; Supplier 3: thegioiic; Supplier 3 Part Number: N/A; Value: 3A, 250 V (AC)
P?#2 = 61300811121: WR-PHD Pin Header, THT, pitch 2.54mm, Single Row, Vertical, 8p; Manufacturer: Wurth Elektronik; Pin Number: 8; Working Voltage: 250VAC; Withstanding Voltage: 500VAC; Contact Resistance: 20mOhm; ComponentLink1Description: Datasheet; ComponentLink1URL: https://www.we-online.com/catalog/datasheet/61300811121.pdf; Manufacturer Part Number: 61300811121; Published Date: May 2020; Pitch: 2.54mm; Packaging: Bag; Gender: Pin Header; Rated Current: 3A; Row Number: Single; Orientation: Vertical; Supplier 1 URL: https://www.mouser.vn/ProductDetail/Wurth-Elektronik/61300811121?qs=PhR8RmCirEZRdx%252BVlEmRRA%3D%3D; Supplier 2 URL: N/A; Supplier 3 URL: N/A; LCSC Part #: N/A; Mount: THT; Operating Temperature Max: + 85 C; Operating Temperature Min: - 25 C; Supplier 1: Mouser; Supplier 1 Part Number: 710-61300811121; Supplier 2: Digi-Key; Supplier 2 Part Number: N/A; Supplier 3: thegioiic; Supplier 3 Part Number: N/A; Value: 3A, 250 V (AC)

## Sheet 08_ADC_measure.SchDoc
size A; SheetNumber: 8; SheetTotal: 8
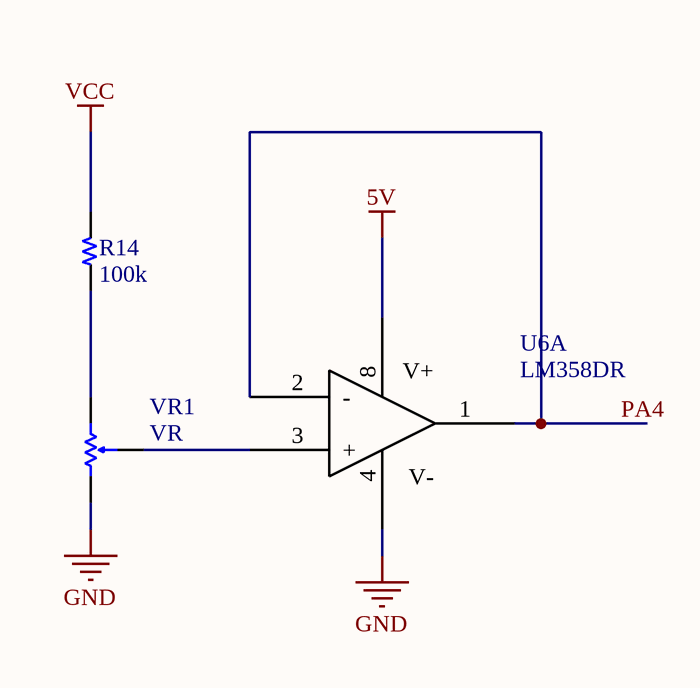
[diagram p7: 08_ADC_measure.SchDoc]

### Parts
R14  100k  [R 0805]
U6  LM358DR  [LM358DR]  (part A of 2)
VR1  VR  [R VAR E]

### Nets
5V: U6.8(VCC)
GND: U6.4(GND) VR1.3
VCC: R14.2
PA4: U6.1(OUT_1) U6.2(-)
NetR14_1: R14.1 VR1.1
NetU6_3: U6.3(+) VR1.2

### Notes on the sheet
- (in symbol LM358DR, part A) V+; V-

### Library data of the parts
R14 = Resistor
U6 = LM358DR: Operational Amplifiers - Op Amps Dual Op Amp; Manufacturer: Texas Instruments; Active Read Current - Max: Active; CMRR - Common Mode Rejection Ratio: 80 dB; Dual Supply Voltage: +/- 3 V, +/- 5 V, +/- 9 V; GBP - Gain Bandwidth Product: 700 kHz; Ib - Input Bias Current: 250 nA; Number of Channels: 2 Channel; Operating Supply Current: 350 uA; Output Current per Channel: 20 mA; SR - Slew Rate: 300 mV/us; Supply Voltage - Max: 32 V; Supply Voltage - Min: 3 V; Voltage Gain dB: 100 dB; Vos - Input Offset Voltage: 7 mV; Supplier 1 URL: https://www.mouser.com/ProductDetail/Texas-Instruments/LM358DR?qs=Zu35EjizYSSY6pJ37yjmHA%3D%3D; Supplier 2 URL: N/A; Supplier 3 URL: N/A; Value: LM358DR; Manufacturer Part Number: LM358DR; Supplier 1: Mouser; Supplier 1 Part Number: 595-LM358DR; Supplier 2: Digi-Key; Supplier 2 Part Number: N/A; Supplier 3: thegioiic; Supplier 3 Part Number: N/A; Mount: SMD/SMT; Operating Temperature Max: + 85 C; Operating Temperature Min: - 40 C; Package / Case: SOIC-8; Packaging: Tape and Reel; ComponentLink1Description: Datasheet; ComponentLink1URL: https://www.ti.com/general/docs/suppproductinfo.tsp?distId=26&gotoUrl=https://www.ti.com/lit/gpn/lm358; LCSC Part #: C5423
VR1 = Resistor Variable

## Nets that join several sheets
5V: 03_Power_Spply (8 pins), 04_MCU (P3.17 P4.3), 08_ADC_measure (U6.8)
GND: 03_Power_Spply (21 pins), 04_MCU (19 pins), 05_Uart_Bluetooth (5 pins), 06_I2C_DS3231 (15 pins), 07_E_ink_display_Button_control (6 pins), 08_ADC_measure (U6.4 VR1.3)
VCC: 03_Power_Spply (7 pins), 08_ADC_measure (R14.2)
VCC3V3: 03_Power_Spply (C12.1 C13.2 U1.2 U1.4), 04_MCU (17 pins), 05_Uart_Bluetooth (U3.12), 06_I2C_DS3231 (R12.1 R13.1 U4.2 U5.8), 07_E_ink_display_Button_control (6 pins)
PA0: 04_MCU (P3.5 U2.10), 07_E_ink_display_Button_control (P?#2.1)
PA1: 04_MCU (P3.6 U2.11), 07_E_ink_display_Button_control (P?#2.2)
PA2: 04_MCU (P3.7 U2.12), 07_E_ink_display_Button_control (P?#2.3)
PA3: 04_MCU (P3.8 U2.13), 07_E_ink_display_Button_control (P?#2.4)
PA4: 04_MCU (P3.9 U2.14), 08_ADC_measure (U6.1 U6.2)
PA5: 04_MCU (P3.10 U2.15), 07_E_ink_display_Button_control (P?#2.5)
PA7: 04_MCU (P3.12 U2.17), 07_E_ink_display_Button_control (P?#2.6)
PA8: 04_MCU (P4.16 U2.29), 07_E_ink_display_Button_control (P?#6.2)
PA9: 04_MCU (P4.15 U2.30), 05_Uart_Bluetooth (U3.2)
PA10: 04_MCU (P4.14 U2.31), 05_Uart_Bluetooth (U3.1)
PB7: 04_MCU (P4.6 U2.43), 06_I2C_DS3231 (R12.2 U4.15 U5.5)
PB8: 04_MCU (P4.5 U2.45), 06_I2C_DS3231 (R13.2 U4.16 U5.6)
PB12: 04_MCU (P4.20 U2.25), 07_E_ink_display_Button_control (P?#1.2)
PB13: 04_MCU (P4.19 U2.26), 07_E_ink_display_Button_control (P?#3.2)
PB14: 04_MCU (P4.18 U2.27), 07_E_ink_display_Button_control (P?#4.2)
PB15: 04_MCU (P4.17 U2.28), 07_E_ink_display_Button_control (P?#5.2)